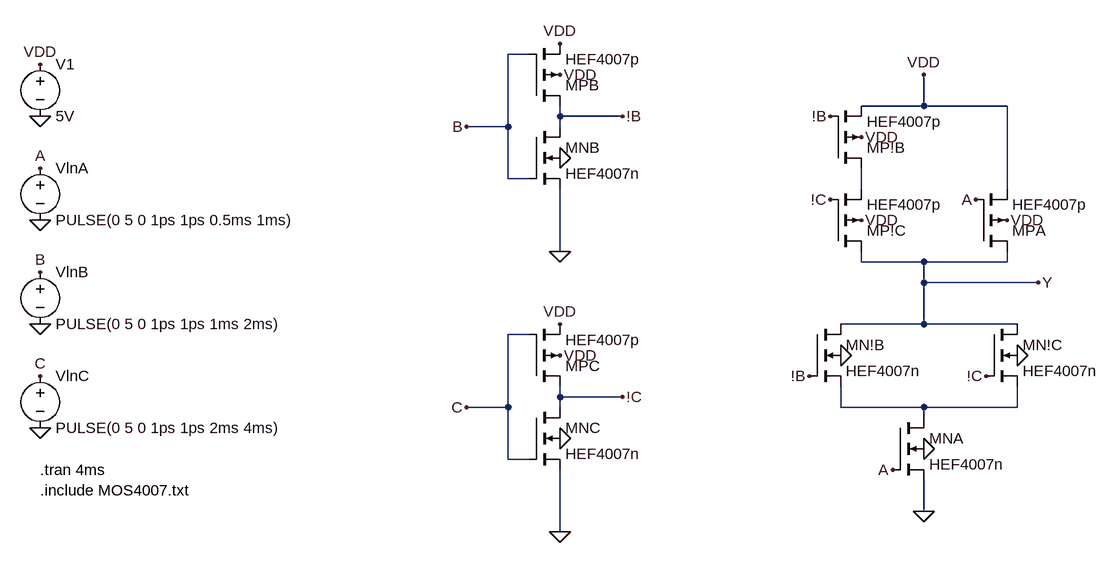
[diagram p0: schematic Gate-CMOS.asc]
Gate-CMOS.asc, the LTspice schematic file:
Version 4
SHEET 1 1972 1236
WIRE 176 144 144 144
WIRE 784 224 784 176
WIRE 784 224 688 224
WIRE 912 224 784 224
WIRE 224 240 224 224
WIRE 320 240 224 240
WIRE 144 256 144 144
WIRE 144 256 80 256
WIRE 224 256 224 240
WIRE 144 336 144 256
WIRE 176 336 144 336
WIRE 688 352 688 320
WIRE 912 352 912 224
WIRE 224 448 224 352
WIRE 688 464 688 448
WIRE 784 464 688 464
WIRE 912 464 912 448
WIRE 912 464 784 464
WIRE 784 496 784 464
WIRE 960 496 784 496
WIRE 784 560 784 496
WIRE 784 560 656 560
WIRE 928 560 784 560
WIRE 176 576 144 576
WIRE 224 672 224 656
WIRE 320 672 224 672
WIRE 144 688 144 576
WIRE 144 688 80 688
WIRE 224 688 224 672
WIRE 656 688 656 656
WIRE 784 688 656 688
WIRE 928 688 928 656
WIRE 928 688 784 688
WIRE 784 704 784 688
WIRE 144 768 144 688
WIRE 176 768 144 768
WIRE 784 848 784 800
WIRE 224 880 224 784
FLAG 80 256 B
FLAG -576 240 0
FLAG 224 448 0
FLAG -576 400 0
FLAG 224 128 VDD
FLAG 80 688 C
FLAG 224 736 0
FLAG 224 608 VDD
FLAG 224 880 0
FLAG 224 560 VDD
FLAG -576 560 0
FLAG -576 720 0
FLAG 320 240 !B
FLAG 320 672 !C
FLAG 784 176 VDD
FLAG 688 272 VDD
FLAG 688 400 VDD
FLAG 640 240 !B
FLAG 960 496 Y
FLAG 656 608 0
FLAG 784 752 0
FLAG 928 608 0
FLAG 640 368 !C
FLAG 736 784 A
FLAG 880 640 !C
FLAG 608 640 !B
FLAG 784 848 0
FLAG -576 160 VDD
FLAG -576 320 A
FLAG -576 480 B
FLAG -576 640 C
FLAG 224 176 VDD
FLAG 224 304 0
FLAG 864 368 A
FLAG 912 400 VDD
SYMBOL voltage -576 144 R0
SYMATTR InstName V1
SYMATTR Value 5V
SYMBOL voltage -576 304 R0
SYMATTR InstName VlnA
SYMATTR Value PULSE(0 5 0 1ps 1ps 0.5ms 1ms)
SYMBOL voltage -576 464 R0
WINDOW 123 0 0 Left 2
WINDOW 39 0 0 Left 2
SYMATTR InstName VlnB
SYMATTR Value PULSE(0 5 0 1ps 1ps 1ms 2ms)
SYMBOL voltage -576 624 R0
SYMATTR InstName VlnC
SYMATTR Value PULSE(0 5 0 1ps 1ps 2ms 4ms)
SYMBOL nmos4 176 256 R0
SYMATTR InstName MNB
SYMATTR Value HEF4007n
SYMBOL pmos4 176 224 M180
SYMATTR InstName MPB
SYMATTR Value HEF4007p
SYMBOL pmos4 176 656 M180
SYMATTR InstName MPC
SYMATTR Value HEF4007p
SYMBOL nmos4 176 688 R0
SYMATTR InstName MNC
SYMATTR Value HEF4007n
SYMBOL pmos4 864 448 M180
SYMATTR InstName MPA
SYMATTR Value HEF4007p
SYMBOL pmos4 640 320 M180
SYMATTR InstName MP!B
SYMATTR Value HEF4007p
SYMBOL pmos4 640 448 M180
SYMATTR InstName MP!C
SYMATTR Value HEF4007p
SYMBOL nmos4 608 560 R0
SYMATTR InstName MN!B
SYMATTR Value HEF4007n
SYMBOL nmos4 880 560 R0
SYMATTR InstName MN!C
SYMATTR Value HEF4007n
SYMBOL nmos4 736 704 R0
SYMATTR InstName MNA
SYMATTR Value HEF4007n
TEXT -576 784 Left 2 !.tran 4ms
TEXT -576 816 Left 2 !.include MOS4007.txt

The netlist it stands for:
* Gate-CMOS.asc
V1 VDD 0 5V
VlnA A 0 PULSE(0 5 0 1ps 1ps 0.5ms 1ms)
VlnB B 0 PULSE(0 5 0 1ps 1ps 1ms 2ms)
VlnC C 0 PULSE(0 5 0 1ps 1ps 2ms 4ms)
MNB !B B 0 0 HEF4007n
MPB !B B VDD VDD HEF4007p
MPC !C C VDD VDD HEF4007p
MNC !C C 0 0 HEF4007n
MPA Y A VDD VDD HEF4007p
MP!B N001 !B VDD VDD HEF4007p
MP!C Y !C N001 VDD HEF4007p
MN!B Y !B N002 0 HEF4007n
MN!C Y !C N002 0 HEF4007n
MNA N002 A 0 0 HEF4007n
.model NMOS NMOS
.model PMOS PMOS
.lib standard.mos
.tran 4ms
.include MOS4007.txt
.backanno
.end